# Altium project ESP32_DEV.PrjPCB
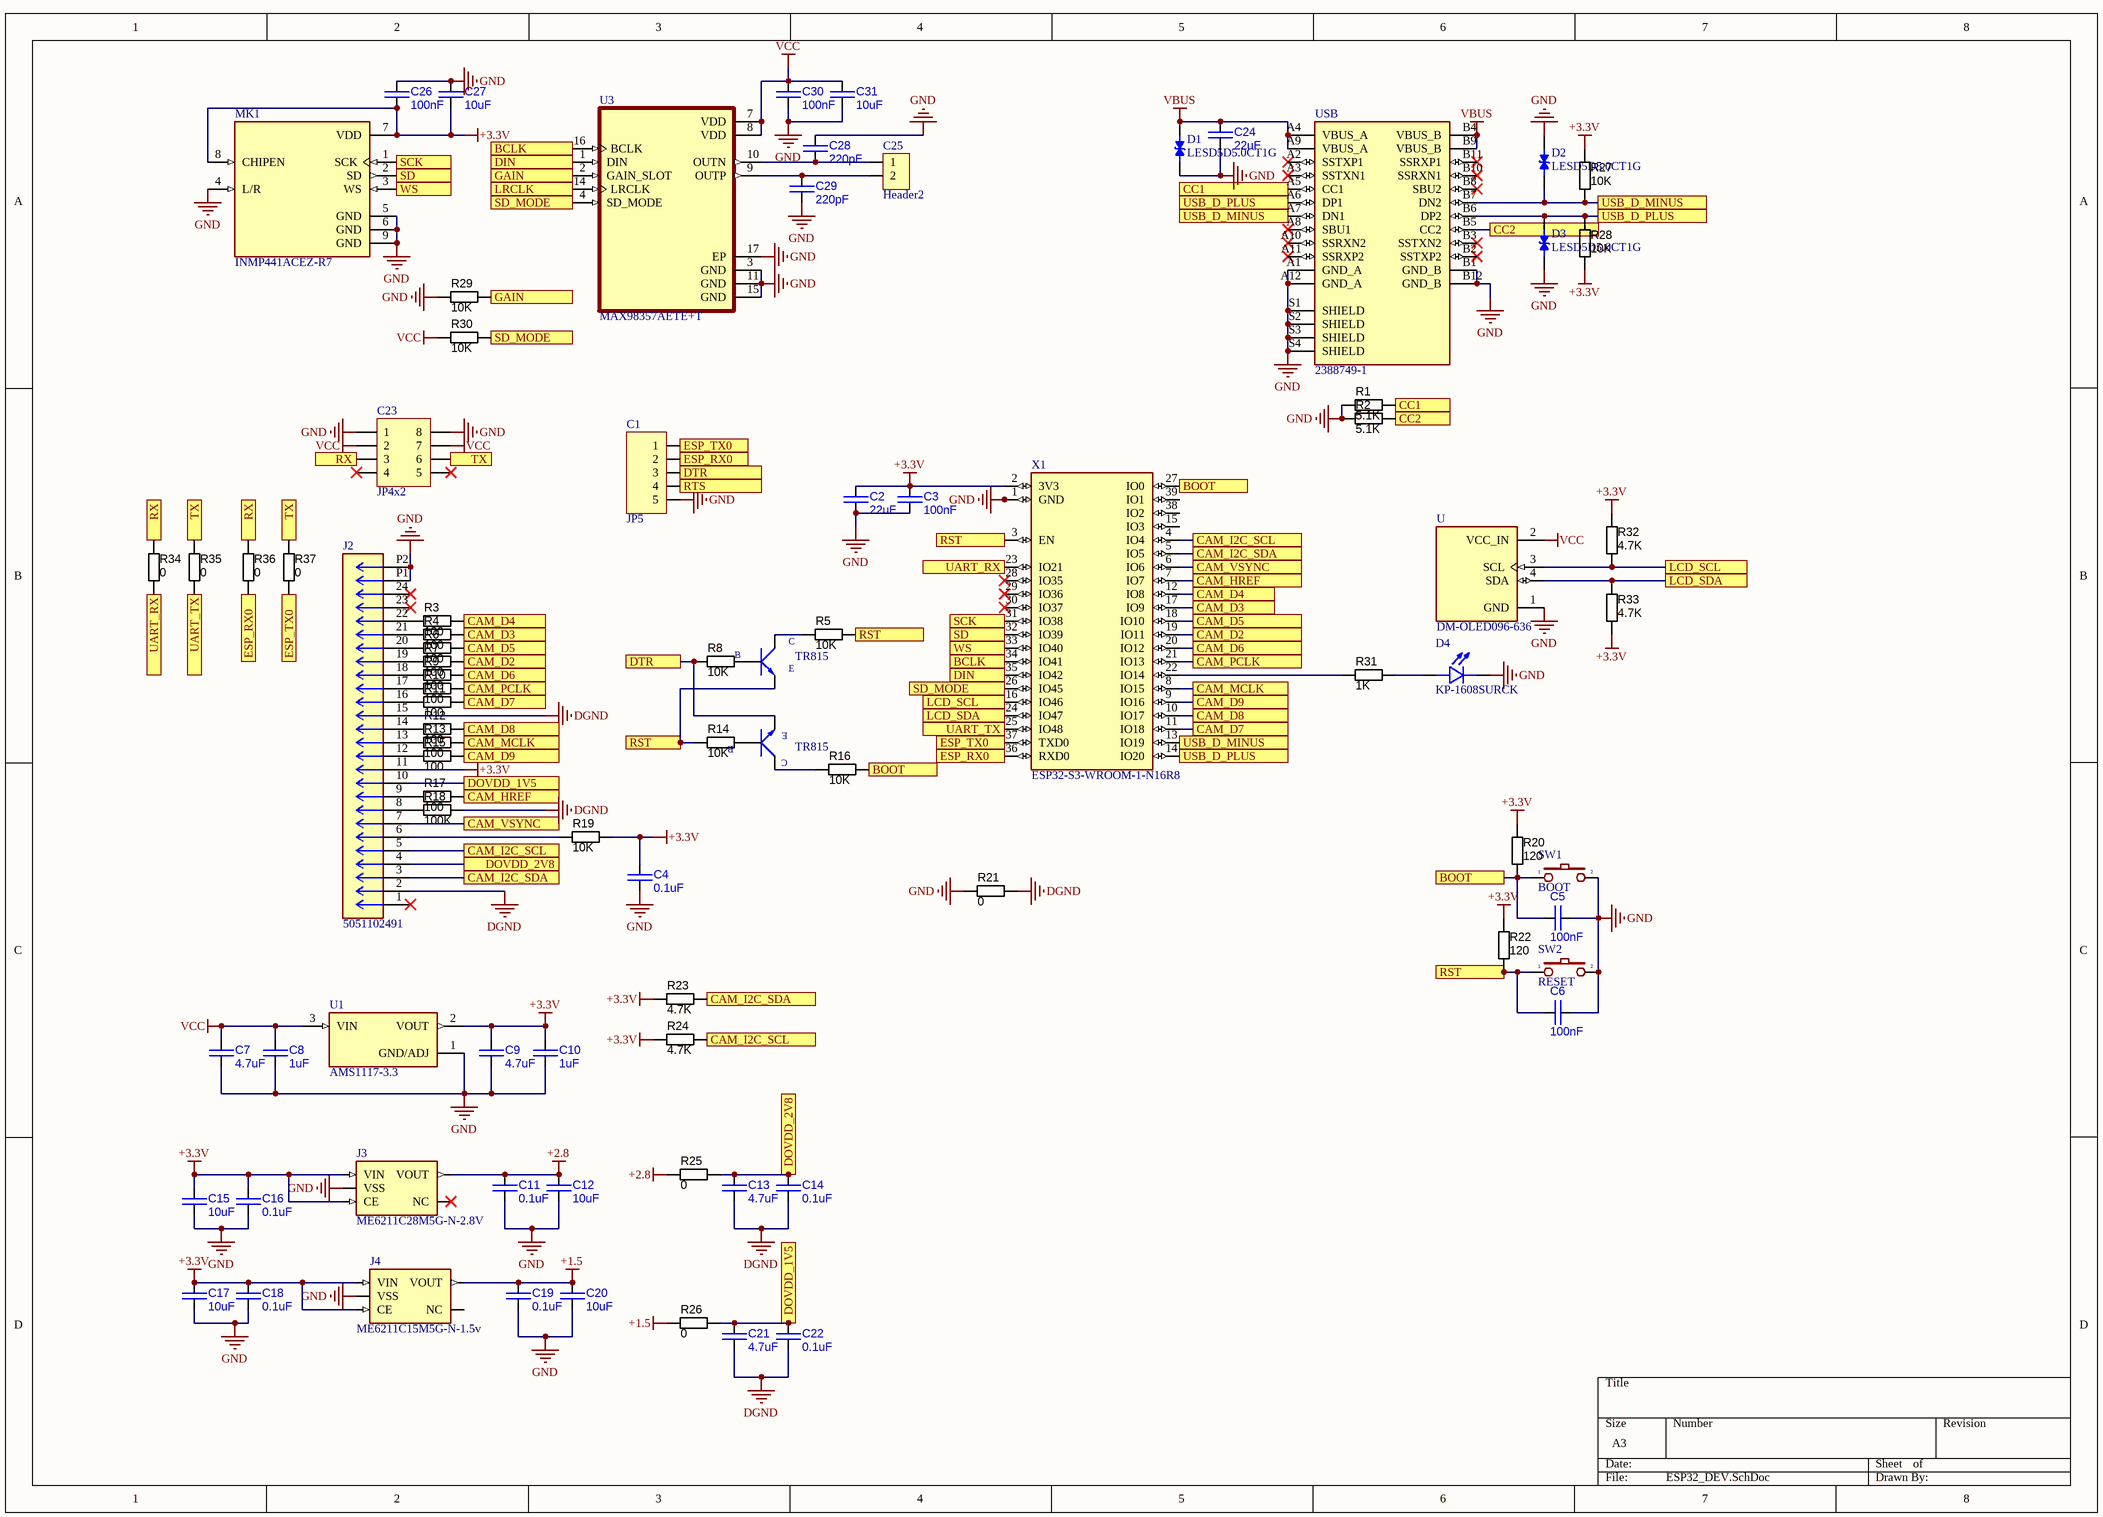
[diagram p0: ESP32_DEV.SchDoc]
1 sheet, 85 parts. Net scope: flat (ports and power ports of the same name join across sheets).
Board file: ESP32_DEV.PcbDoc

## Sheet ESP32_DEV.SchDoc
size A3

### Parts
C1  JP5  [JP5-D1C]
C2  22uF  [CAPC1005X55N]
C3  100nF  [CAPC1005X55N]
C4  0.1uF  [CAPC1005X55N]
C5  100nF  [CAPC1005X55N]
C6  100nF  [CAPC1005X55N]
C7  4.7uF  [CAPC1005X55N]
C8  1uF  [CAPC1005X55N]
C9  4.7uF  [CAPC1005X55N]
C10  1uF  [CAPC1005X55N]
C11  0.1uF  [CAPC1005X55N]
C12  10uF  [CAPC1005X55N]
C13  4.7uF  [CAPC1005X55N]
C14  0.1uF  [CAPC1005X55N]
C15  10uF  [CAPC1005X55N]
C16  0.1uF  [CAPC1005X55N]
C17  10uF  [CAPC1005X55N]
C18  0.1uF  [CAPC1005X55N]
C19  0.1uF  [CAPC1005X55N]
C20  10uF  [CAPC1005X55N]
C21  4.7uF  [CAPC1005X55N]
C22  0.1uF  [CAPC1005X55N]
C23  JP4x2  [JP4-C2T]
C24  22uF  [CAPC1005X55N]
C25  Header2  [Header2]
C26  100nF  [CAPC1005X55N]
C27  10uF  [CAPC1005X55N]
C28  220pF  [CAPC1005X55N]
C29  220pF  [CAPC1005X55N]
C30  100nF  [CAPC1005X55N]
C31  10uF  [CAPC1005X55N]
D1  LESD5D5.0CT1G  [TVS_LESD5D5.0CT1G]
D2  LESD5D5.0CT1G  [TVS_LESD5D5.0CT1G]
D3  LESD5D5.0CT1G  [TVS_LESD5D5.0CT1G]
D4  KP-1608SURCK  [LED_KP-1608SURCK]
J2  5051102491  [CON_5051102491_MOL]
J3  ME6211C28M5G-N-2.8V  [SOT25]
J4  ME6211C15M5G-N-1.5v  [SOT25]
MK1  INMP441ACEZ-R7  [MIC_INMP441ACEZ-R7]
R1  value 5.1K  [RESC1005X40N]  (hidden comment: Thick Film)
R2  value 5.1K  [RESC1005X40N]  (hidden comment: Thick Film)
R3  value 100  [RESC1005X40N]  (hidden comment: Thick Film)
R4  value 100  [RESC1005X40N]  (hidden comment: Thick Film)
R5  value 10K  [RESC1005X40N]  (hidden comment: Thick Film)
R6  value 100  [RESC1005X40N]  (hidden comment: Thick Film)
R7  value 100  [RESC1005X40N]  (hidden comment: Thick Film)
R8  value 10K  [RESC1005X40N]  (hidden comment: Thick Film)
R9  value 100  [RESC1005X40N]  (hidden comment: Thick Film)
R10  value 100  [RESC1005X40N]  (hidden comment: Thick Film)
R11  value 100  [RESC1005X40N]  (hidden comment: Thick Film)
R12  value 100  [RESC1005X40N]  (hidden comment: Thick Film)
R13  value 100  [RESC1005X40N]  (hidden comment: Thick Film)
R14  value 10K  [RESC1005X40N]  (hidden comment: Thick Film)
R15  value 100  [RESC1005X40N]  (hidden comment: Thick Film)
R16  value 10K  [RESC1005X40N]  (hidden comment: Thick Film)
R17  value 100  [RESC1005X40N]  (hidden comment: Thick Film)
R18  value 100K  [RESC1005X40N]  (hidden comment: Thick Film)
R19  value 10K  [RESC1005X40N]  (hidden comment: Thick Film)
R20  value 120  [RESC1005X40N]  (hidden comment: Thick Film)
R21  value 0  [RESC1005X40N]  (hidden comment: Thick Film)
R22  value 120  [RESC1005X40N]  (hidden comment: Thick Film)
R23  value 4.7K  [RESC1005X40N]  (hidden comment: Thick Film)
R24  value 4.7K  [RESC1005X40N]  (hidden comment: Thick Film)
R25  value 0  [RESC1005X40N]  (hidden comment: Thick Film)
R26  value 0  [RESC1005X40N]  (hidden comment: Thick Film)
R27  value 10K  [RESC1005X40N]  (hidden comment: Thick Film)
R28  value 10K  [RESC1005X40N]  (hidden comment: Thick Film)
R29  value 10K  [RESC1005X40N]  (hidden comment: Thick Film)
R30  value 10K  [RESC1005X40N]  (hidden comment: Thick Film)
R31  value 1K  [RESC1005X40N]  (hidden comment: Thick Film)
R32  value 4.7K  [RESC1005X40N]  (hidden comment: Thick Film)
R33  value 4.7K  [RESC1005X40N]  (hidden comment: Thick Film)
R34  value 0  [RESC1005X40N]  (hidden comment: Thick Film)
R35  value 0  [RESC1005X40N]  (hidden comment: Thick Film)
R36  value 0  [RESC1005X40N]  (hidden comment: Thick Film)
R37  value 0  [RESC1005X40N]  (hidden comment: Thick Film)
STA.TR1  TR815  [SOT-23B_L]
STA.TR2  TR815  [SOT-23B_L]
SW1  BOOT  [SW1-SMD]
SW2  RESET  [SW1-SMD]
U  DM-OLED096-636  [MODULE_DM-OLED096-636]
U1  AMS1117-3.3  [SOT229P700X180-4N]
U3  MAX98357AETE+T  [QFN50P300X300X80-17N]
USB  2388749-1  [TE_2388749-1]
X1  ESP32-S3-WROOM-1-N16R8  [ESP32S3WROOM1N8R2]

### Ports
BCLK, BOOT, CAM_D2, CAM_D3, CAM_D4, CAM_D5, CAM_D6, CAM_D7, CAM_D8, CAM_D9, CAM_HREF, CAM_I2C_SCL, CAM_I2C_SDA, CAM_MCLK, CAM_PCLK, CAM_VSYNC, CC1, CC2, DIN, DOVDD_1V5, DOVDD_2V8, DTR, ESP_RX0, ESP_TX0, GAIN, LCD_SCL, LCD_SDA, LRCLK, RST, RTS, RX, SCK, SD, SD_MODE, TX, UART_RX, UART_TX, USB_D_MINUS, USB_D_PLUS, WS

### Nets
+1.5: C19.2 C20.2 J4.P$4(VOUT) R26.2
+2.8: C11.2 C12.2 J3.P$4(VOUT) R25.2
+3.3V: C2.2 C3.2 C4.2 C9.2 C10.2 C15.2 C16.2 C17.2 C18.2 C26.1 C27.1 J2.11 J3.P$1(VIN) J3.P$3(CE) J4.P$1(VIN) J4.P$3(CE) MK1.7(VDD) MK1.8(CHIPEN) R19.1 R20.1 R22.1 R23.2 R24.2 R27.1 R28.2 R32.1 R33.2 U1.2(VOUT) X1.2(3V3)
DGND: C13.1 C14.1 C21.1 C22.1 J2.2 J2.15 R18.1 R21.1
GND: C1.5 C2.1 C3.1 C4.1 C5.1 C6.1 C7.1 C8.1 C9.1 C10.1 C11.1 C12.1 C15.1 C16.1 C17.1 C18.1 C19.1 C20.1 C23.1 C23.8 C24.1 C26.2 C27.2 C28.2 C29.1 C30.1 C31.1 D1.1 D2.2 D3.1 D4.2(C) J2.P1 J2.P2 J3.P$2(VSS) J4.P$2(VSS) MK1.4(L/R) MK1.5(GND) MK1.6(GND) MK1.9(GND) R1.1 R2.1 R21.2 R29.2 SW1.2 SW2.2 U.1(GND) U1.1(GND/ADJ) U3.3(GND) U3.11(GND) U3.15(GND) U3.17(EP) USB.A1(GND_A) USB.A12(GND_A) USB.B1(GND_B) USB.B12(GND_B) USB.S1(SHIELD) USB.S2(SHIELD) USB.S3(SHIELD) USB.S4(SHIELD) X1.1(GND) X1.40(GND) X1.41(GND) X1.42(GND) X1.43(GND) X1.44(GND) X1.45(GND) X1.46(GND) X1.47(GND) X1.48(GND) X1.49(GND)
VBUS: C24.2 D1.2 USB.A4(VBUS_A) USB.A9(VBUS_A) USB.B4(VBUS_B) USB.B9(VBUS_B)
VCC: C7.2 C8.2 C23.2 C23.7 C30.2 C31.2 R30.2 U.2(VCC_IN) U1.3(VIN) U3.7(VDD) U3.8(VDD)
NetC1_1: C1.1 R37.2 X1.37(TXD0) ; port ESP_TX0
NetC1_2: C1.2 R36.2 X1.36(RXD0) ; port ESP_RX0
NetC1_3: C1.3 R8.2 STA.TR2.1(E) ; port DTR
NetC1_4: C1.4 ; port RTS
NetC5_2: C5.2 R16.1 R20.2 SW1.1 X1.27(IO0) ; port BOOT
NetC6_2: C6.2 R5.1 R14.2 R22.2 STA.TR1.1(E) SW2.1 X1.3(EN) ; port RST
NetC13_2: C13.2 C14.2 J2.4 R25.1 ; port DOVDD_2V8
NetC21_2: C21.2 C22.2 J2.10 R26.1 ; port DOVDD_1V5
NetC23_3: C23.3 R34.1 R36.1 ; port RX
NetC23_6: C23.6 R35.1 R37.1 ; port TX
NetC25_1: C25.1 C28.1 U3.10(OUTN)
NetC25_2: C25.2 C29.2 U3.9(OUTP)
NetD2_1: D2.1 R27.2 USB.A7(DN1) USB.B7(DN2) X1.13(IO19) ; port USB_D_MINUS
NetD3_2: D3.2 R28.1 USB.A6(DP1) USB.B6(DP2) X1.14(IO20) ; port USB_D_PLUS
NetD4_1: D4.1(A) R31.1
NetJ2_3: J2.3 R23.1 X1.5(IO5) ; port CAM_I2C_SDA
NetJ2_5: J2.5 R24.1 X1.4(IO4) ; port CAM_I2C_SCL
NetJ2_6: J2.6 R19.2
NetJ2_7: J2.7 X1.6(IO6) ; port CAM_VSYNC
NetJ2_8: J2.8 R18.2
NetJ2_9: J2.9 R17.2
NetJ2_12: J2.12 R15.2
NetJ2_13: J2.13 R13.2
NetJ2_14: J2.14 R12.2
NetJ2_16: J2.16 R11.2
NetJ2_17: J2.17 R10.2
NetJ2_18: J2.18 R9.2
NetJ2_19: J2.19 R7.2
NetJ2_20: J2.20 R6.2
NetJ2_21: J2.21 R4.2
NetJ2_22: J2.22 R3.2
NetMK1_1: MK1.1(SCK) X1.31(IO38) ; port SCK
NetMK1_2: MK1.2(SD) X1.32(IO39) ; port SD
NetMK1_3: MK1.3(WS) X1.33(IO40) ; port WS
NetR1_2: R1.2 USB.A5(CC1) ; port CC1
NetR2_2: R2.2 USB.B5(CC2) ; port CC2
NetR3_1: R3.1 X1.12(IO8) ; port CAM_D4
NetR4_1: R4.1 X1.17(IO9) ; port CAM_D3
NetR5_2: R5.2 STA.TR1.2(C)
NetR6_1: R6.1 X1.18(IO10) ; port CAM_D5
NetR7_1: R7.1 X1.19(IO11) ; port CAM_D2
NetR8_1: R8.1 STA.TR1.3(B)
NetR9_1: R9.1 X1.20(IO12) ; port CAM_D6
NetR10_1: R10.1 X1.21(IO13) ; port CAM_PCLK
NetR11_1: R11.1 X1.11(IO18) ; port CAM_D7
NetR12_1: R12.1 X1.10(IO17) ; port CAM_D8
NetR13_1: R13.1 X1.8(IO15) ; port CAM_MCLK
NetR14_1: R14.1 STA.TR2.3(B)
NetR15_1: R15.1 X1.9(IO16) ; port CAM_D9
NetR16_2: R16.2 STA.TR2.2(C)
NetR17_1: R17.1 X1.7(IO7) ; port CAM_HREF
NetR29_1: R29.1 U3.2(GAIN_SLOT) ; port GAIN
NetR30_1: R30.1 U3.4(SD_MODE) X1.26(IO45) ; port SD_MODE
NetR31_2: R31.2 X1.22(IO14)
NetR32_2: R32.2 U.3(SCL) X1.16(IO46) ; port LCD_SCL
NetR33_1: R33.1 U.4(SDA) X1.24(IO47) ; port LCD_SDA
NetR34_2: R34.2 X1.23(IO21) ; port UART_RX
NetR35_2: R35.2 X1.25(IO48) ; port UART_TX
NetU3_1: U3.1(DIN) X1.35(IO42) ; port DIN
NetU3_14: U3.14(LRCLK) ; port LRCLK
NetU3_16: U3.16(BCLK) X1.34(IO41) ; port BCLK

Not connected (* = marked no-connect by the designer): C23 4* 5*; J2 1* 23* 24*; J3 P$5(NC)*; J4 P$5(NC); USB A2(SSTXP1)* A3(SSTXN1)* A8(SBU1)* A10(SSRXN2)* A11(SSRXP2)* B2(SSTXP2)* B3(SSTXN2)* B8(SBU2)* B10(SSRXN1)* B11(SSRXP1)*; X1 15(IO3) 28(IO35)* 29(IO36)* 30(IO37)* 38(IO2) 39(IO1)

### Library data of the parts
C1 = JP5: WR-PHD 2.54 mm Angled Socket Header; Manufacturer: W¨¹rth Elektronik eiSos GmbH; partNo: 613005143121; ComponentLink1 Description: Manufacturer; ComponentLink2 Description: Datasheet; NoPins: 05; Created Date: 29 March 2013; ComponentLink1URL: http://www.we-online.com; ComponentLink2URL: http://katalog.we-online.de/em/datasheet/6130xx143121.pdf; Created by: Karrer Zheng
C2-C22 C24 C26-C31 = CAP C_0402: Capacitor SMD Cer 1nF 10% 16V X7R 0402; Manufacturer 1: AVX Corporation; Manufacturer Part Number 1: 0402YC102KAT2A; Ratings: 16V; X7R; SCDType: spec; Tolerance: ±10%; Operating Temperature: -55°C ~ 125°C; Package / Case: 0402 (1005 Metric); Size / Dimension: 0.039" L x 0.020" W (1.00mm x 0.50mm); Manufacturer 2: Yageo; Manufacturer Part Number 2: CC0402KRX7R7BB102; Supplier 1: Digi-Key; Supplier Part Number 1: 478-6197-1-ND; ComponentLink1URL: http://www.avx.com/docs/Catalogs/cx7r.pdf; ComponentLink1Description: http://www.avx.com/docs/Catalogs/cx7r.pdf; Supplier 2: Digi-Key; Supplier Part Number 2: 311-1352-1-ND; ComponentLink2URL: http://www.yageo.com/documents/recent/UPY-GPHC_X7R_6.3V-to-50V_8.pdf; ComponentLink2Description: http://www.yageo.com/documents/recent/UPY-GPHC_X7R_6.3V-to-50V_8.pdf
  C2 C24: Value: 22uF
  C3 C5 C6 C26 C30: Value: 100nF
  C4 C11 C14 C16 C18 C19 C22: Value: 0.1uF
  C7 C9 C13 C21: Value: 4.7uF
  C8 C10: Value: 1uF
  C12 C15 C17 C20 C27 C31: Value: 10uF
  C28 C29: Value: 220pF
C23 = JP4x2: WR-PHD 2.54 mm Dual Socket Header; Manufacturer: W¨¹rth Elektronik eiSos GmbH; partNo: 61300821821; ComponentLink1 Description: Manufacturer; ComponentLink2 Description: Datasheet; NoPins: 08; Created Date: 29 March 2013; ComponentLink1URL: http://www.we-online.com; ComponentLink2URL: http://katalog.we-online.de/em/datasheet/6130xx21821.pdf; Created by: Karrer Zheng
C25 = Header2: Header IDC, 2 x 1 Pin Vertical 2.54mm Pitch (Non-Boxed, Male); Manufacturer: W¨¹rth Elektronik eiSos GmbH; partNo: 613002143121; ComponentLink1 Description: Manufacturer; ComponentLink2 Description: Datasheet; NoPins: 02; Created Date: 29 March 2013; ComponentLink1URL: http://www.we-online.com; ComponentLink2URL: http://katalog.we-online.de/em/datasheet/6130xx143121.pdf; Created by: Karrer Zheng
D1-D3 = LESD5D5.0CT1G: Transient Voltage Suppressors for ESD Protection; MF: Leshan Radio Co.; Check_prices: https://www.snapeda.com/parts/LESD5D5.0CT1G/Leshan+Radio+Co./view-part/?ref=eda; Value: *; Availability: Not in stock; Package: None; SnapEDA_Link: https://www.snapeda.com/parts/LESD5D5.0CT1G/Leshan+Radio+Co./view-part/?ref=snap; MP: LESD5D5.0CT1G; Price: None
D4 = KP-1608SURCK: LED; SMD; 0603; red; 50-150mcd; 1.6x0.8mm; 120Â°; 20mA;; MF: Kingbright; SnapEDA_Link: https://www.snapeda.com/parts/KP-1608SURCK/Kingbright/view-part/?ref=snap; Package: 0603 Kingbright; Value: *; MP: KP-1608SURCK; Check_prices: https://www.snapeda.com/parts/KP-1608SURCK/Kingbright/view-part/?ref=eda
J2 = 5051102491: 24 Position FFC, FPC Connector Contacts, Bottom 0.020 (0.50mm) Surface Mount, Right Angle; MF: Molex; SnapEDA_Link: https://www.snapeda.com/parts/5051102491/Molex/view-part/?ref=snap; Package: None; Value: *; MP: 5051102491; Check_prices: https://www.snapeda.com/parts/5051102491/Molex/view-part/?ref=eda
J3 J4 = XC6222B281MR-G: Linear Voltage Regulator IC Positive Fixed 1 Output 700mA SOT-25-5; MF: Torex; SnapEDA_Link: https://www.snapeda.com/parts/XC6222B281MR-G/Torex/view-part/?ref=snap; Package: SOT-753 Torex; Value: *; MP: XC6222B281MR-G; Check_prices: https://www.snapeda.com/parts/XC6222B281MR-G/Torex/view-part/?ref=eda
MK1 = INMP441ACEZ-R7: 60 Hz ~ 15 kHz Digital, I2S Microphone MEMS (Silicon) 1.62 V ~ 3.63 V Omnidirectional (-26dB Â±3dB @ 94dB SPL) Solder Pads; MF: TDK InvenSense; SnapEDA_Link: https://www.snapeda.com/parts/INMP441ACEZ-R7/TDK/view-part/?ref=snap; Package: LGA-9 TDK InvenSense; Value: *; MP: INMP441ACEZ-R7; Check_prices: https://www.snapeda.com/parts/INMP441ACEZ-R7/TDK/view-part/?ref=eda
R1-R37 = RES_0402: Resistor SMD chip 1k Ohm 0.063W 5% 0402; Manufacturer 1: Yageo; Manufacturer Part Number 1: RC0402JR-071KL; Ratings: 1/16 W; SCDType: spec; Package / Case: 0402 (1005 Metric); Tolerance: ±5%; Supplier 1: Digi-Key; Supplier Part Number 1: 311-1.0KJRCT-ND; RoHS 1: RoHS Compliant; ComponentLink1URL: http://www.yageo.com/documents/recent/PYu-RC0402_51_RoHS_L_6.pdf; ComponentLink1Description: http://www.yageo.com/documents/recent/PYu-RC0402_51_RoHS_L_6.pdf; Supplier 2: Digi-Key; Supplier Part Number 2: 541-1.0KJCT-ND; Manufacturer 2: Vishay Dale; Manufacturer Part Number 2: CRCW04021K00JNED; RoHS 2: RoHS Compliant; ComponentLink2URL: http://www.vishay.com/doc?20035; ComponentLink2Description: http://www.vishay.com/doc?20035; Supplier 3: Digi-Key; Supplier Part Number 3: 1276-4376-1-ND; Manufacturer 3: Samsung Electro-Mechanics America, Inc; Manufacturer Part Number 3: RC1005J102CS; RoHS 3: RoHS Compliant; ComponentLink3URL: http://www.samsungsem.com/servlet/FileDownload?filename=productcatalog/pdf/Chip_Resistor.pdf; ComponentLink3Description: http://www.samsungsem.com/servlet/FileDownload?filename=productcatalog/pdf/Chip_Resistor.pdf; Supplier 4: Digi-Key; Supplier Part Number 4: RHM1.0KCECT-ND; Manufacturer 4: Rohm Semiconductor; Manufacturer Part Number 4: MCR01MRTJ102; RoHS 4: RoHS Compliant; ComponentLink4URL: http://rohmfs.rohm.com/en/products/databook/datasheet/passive/resistor/chip_resistor/mcr_g.pdf; ComponentLink4Description: http://rohmfs.rohm.com/en/products/databook/datasheet/passive/resistor/chip_resistor/mcr_g.pdf; Supplier 5: Digi-Key; Supplier Part Number 5: P1.0KJCT-ND; Manufacturer 5: Panasonic Electronic Components; Manufacturer Part Number 5: ERJ-2GEJ102X; RoHS 5: RoHS Compliant; ComponentLink5URL: http://industrial.panasonic.com/www-cgi/jvcr13pz.cgi?E+PZ+3+AOA0001+ERJ2GEJ102X+7+WW; ComponentLink5Description: http://industrial.panasonic.com/www-cgi/jvcr13pz.cgi?E+PZ+3+AOA0001+ERJ2GEJ102X+7+WW
STA.TR1 STA.TR2 = C1815: NPN 600mW, ECB; Value: C1815
SW1 SW2 = SW2: Switch button 2 pin; Value: SW chip 2 pin
U = DM-OLED096-636: 0.96â€ 128 X 64 MONOCHROME GRAPHIC OLED DISPLAY MODULE - I2C; SnapEDA_Link: https://www.snapeda.com/parts/DM-OLED096-636/Display+Module/view-part/?ref=snap; Package: Package; Value: *; MF: Display Module; MP: DM-OLED096-636; Check_prices: https://www.snapeda.com/parts/DM-OLED096-636/Display+Module/view-part/?ref=eda
U1 = AMS1117-3.3: Sot223/Pkg 1-Amp 3.3-Volt Low Drop Out Voltage Regulatator; MF: Advanced Monolithic Systems; SnapEDA_Link: https://www.snapeda.com/parts/AMS1117-3.3/Advanced+Monolithic+Systems/view-part/?ref=snap; Package: SOT-223 Seeed Technology; Value: *; MP: AMS1117-3.3; Check_prices: https://www.snapeda.com/parts/AMS1117-3.3/Advanced+Monolithic+Systems/view-part/?ref=eda
U3 = MAX98357AETE+T: Tiny, Low-Cost, PCM Class D Amplifier with Class AB Performance; MF: Analog Devices; SnapEDA_Link: https://www.snapeda.com/parts/MAX98357AETE+T/Analog+Devices/view-part/?ref=snap; Package: TQFN-16 Maxim; Value: *; MP: MAX98357AETE+T; Check_prices: https://www.snapeda.com/parts/MAX98357AETE+T/Analog+Devices/view-part/?ref=eda
USB = 2388749-1: USB-C (USB TYPE-C) USB 4.0 Receptacle Connector 24 Position Board Edge, Cutout; Surface Mount; Through Hole, Right Angle; MF: TE Connectivity; SnapEDA_Link: https://www.snapeda.com/parts/2388749-1/TE+Connectivity/view-part/?ref=snap; Package: None; Value: *; MP: 2388749-1; Check_prices: https://www.snapeda.com/parts/2388749-1/TE+Connectivity/view-part/?ref=eda
X1 = ESP32-S3-WROOM-1-N16R8: Bluetooth, WiFi 802.11b/g/n, Bluetooth v5.0 Transceiver Module 2.4GHz PCB Trace Surface Mount; MF: Espressif Systems; SnapEDA_Link: https://www.snapeda.com/parts/ESP32-S3-WROOM-1-N16R8/Espressif+Systems/view-part/?ref=snap; Package: NON STANDARD Espressif Systems; Value: *; MP: ESP32-S3-WROOM-1-N16R8; Check_prices: https://www.snapeda.com/parts/ESP32-S3-WROOM-1-N16R8/Espressif+Systems/view-part/?ref=eda